# EAGLE design opt2bnc_trigger (EAGLE 9.4.2)
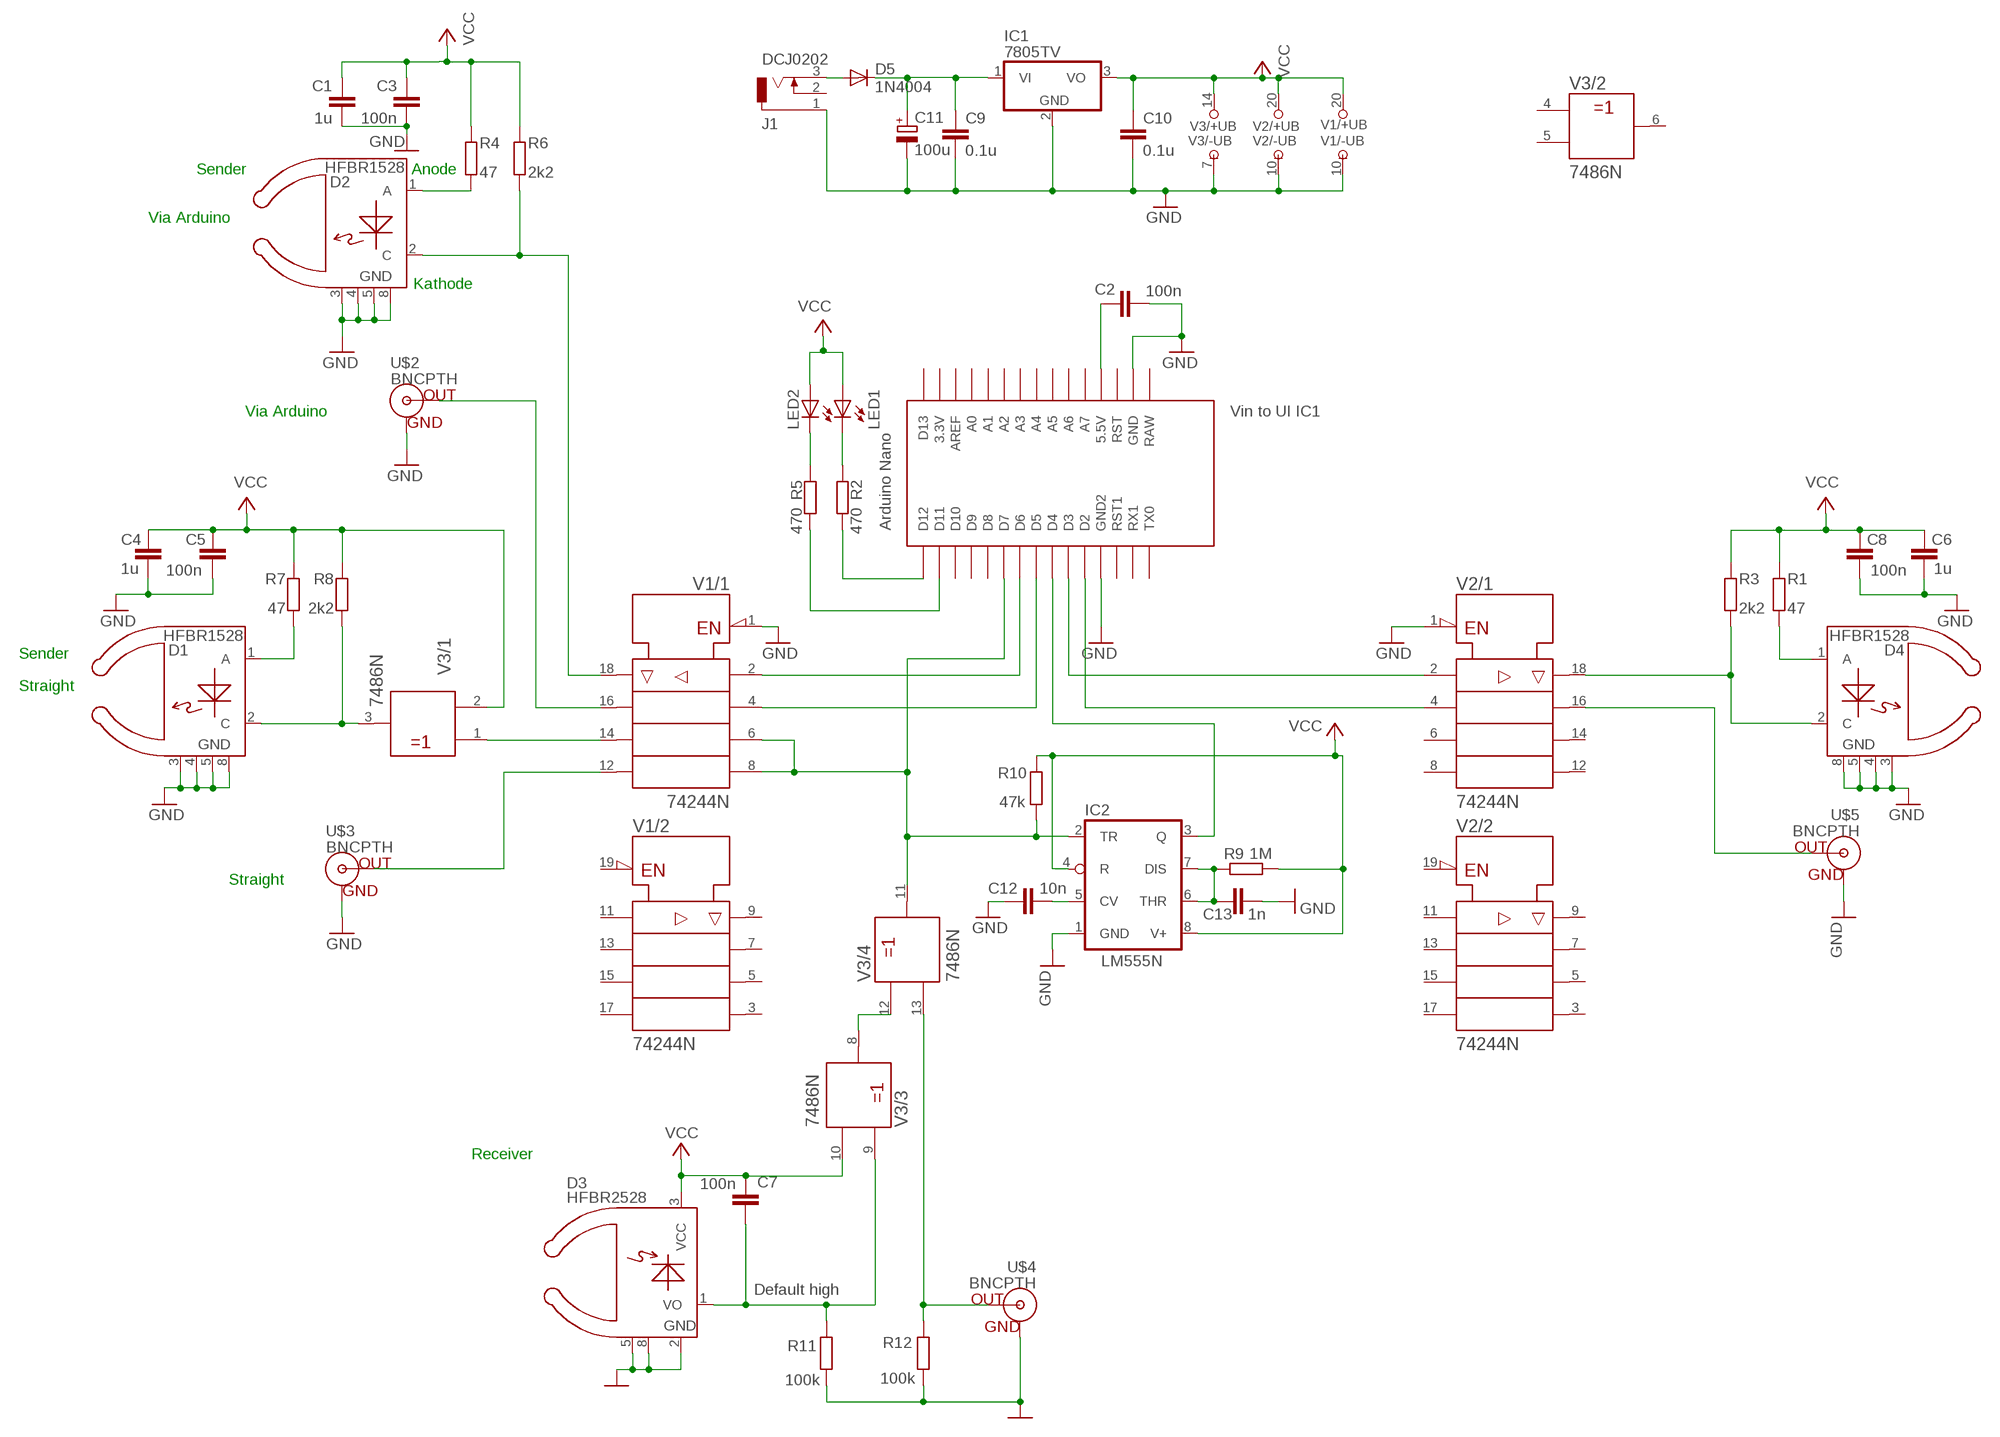
[diagram p0: schematic, sheet 1]

## Parts
C1  1u  C-EU025-025X050  [C025-025X050]
C2  100n  C-EU025-025X050  [C025-025X050]
C3  100n  C-EU025-025X050  [C025-025X050]
C4  1u  C-EU025-025X050  [C025-025X050]
C5  100n  C-EU025-025X050  [C025-025X050]
C6  1u  C-EU025-025X050  [C025-025X050]
C7  100n  C-EU025-025X050  [C025-025X050]
C8  100n  C-EU025-025X050  [C025-025X050]
C9  0.1u  C-EU025-024X044  [C025-024X044]
C10  0.1u  C-EU025-024X044  [C025-024X044]
C11  100u  CPOL-EUE2-4  [E2-4]
C12  10n  C-EU025-025X050  [C025-025X050]
C13  1n  C-EU025-025X050  [C025-025X050]
D1  HFBR1528  [HFBR25XX]
D2  HFBR1528  [HFBR25XX]
D3  HFBR2528  [HFBR25XX]
D4  HFBR1528  [HFBR25XX]
D5  1N4004  [DO41-10]
IC1  7805TV  [TO220V]
IC2  LM555N  [DIL08]
J1  DCJ0202  [DCJ0202]
LED1  LED3MM  [LED3MM]
LED2  LED3MM  [LED3MM]
R1  47  R-EU_0207/7  [0207/7]
R2  470  R-EU_0207/7  [0207/7]
R3  2k2  R-EU_0207/7  [0207/7]
R4  47  R-EU_0207/7  [0207/7]
R5  470  R-EU_0207/7  [0207/7]
R6  2k2  R-EU_0207/7  [0207/7]
R7  47  R-EU_0207/7  [0207/7]
R8  2k2  R-EU_0207/7  [0207/7]
R9  1M  R-EU_0207/7  [0207/7]
R10  47k  R-EU_0207/7  [0207/7]
R11  100k  R-EU_0207/7  [0207/7]
R12  100k  R-EU_0207/7  [0207/7]
U$1  NANO  [NANO]
U$2  BNCPTH  [BNC]
U$3  BNCPTH  [BNC]
U$4  BNCPTH  [BNC]
U$5  BNCPTH  [BNC]
V1  74244N  [DIL20]
V2  74244N  [DIL20]
V3  7486N  [DIL14]

## Nets
GND: C1.2 C2.2 C3.2 C4.2 C5.2 C6.2 C8.2 C9.2 C10.2 C11.- C12.1 C13.2 D1.3 D1.4 D1.5(GND) D1.8(GND) D2.3 D2.4 D2.5(GND) D2.8(GND) D3.2(GND) D3.5 D3.8 D4.3 D4.4 D4.5(GND) D4.8(GND) IC1.2(GND) IC2.1(GND) J1.1 R11.2 R12.2 U$1.GND U$1.GND1(GND2) U$2.GND U$3.GND U$4.GND U$5.GND V1.1(/1:!G) V1.10(/-UB:-UB) V2.1(/1:!G) V2.10(/-UB:-UB) V3.7(/-UB:-UB)
N$1: C9.1 C11.+ D5.C IC1.1(VI)
N$2: IC2.2(TR) R10.2 U$1.D7 V1.6(/1:A3) V1.8(/1:A4) V3.11(/4:Y)
N$3: D2.2(C) R6.1 V1.18(/1:Y1)
N$4: LED1.K(C) R2.1
N$5: U$1.D6 V1.2(/1:A1)
N$6: U$2.S(OUT) V1.16(/1:Y2)
N$7: U$1.D5 V1.4(/1:A2)
N$8: LED2.K(C) R5.1
N$9: C7.1 D3.1(VO) R11.1 V3.9(/3:A)
N$10: D2.1(A) R4.1
N$11: D5.A J1.3
N$12: R2.2 U$1.D12
N$13: R5.2 U$1.D11
N$14: D1.1(A) R7.1
N$15: U$3.S(OUT) V1.12(/1:Y4)
N$16: C2.1 U$1.5V(5.5V)
N$19: U$1.D2 V2.4(/1:A2)
N$20: U$1.D3 V2.2(/1:A1)
N$21: D1.2(C) R8.1 V3.3(/1:Y)
N$22: U$5.S(OUT) V2.16(/1:Y2)
N$23: D4.1(A) R1.1
N$24: D4.2(C) R3.1 V2.18(/1:Y1)
N$26: R12.1 U$4.S(OUT) V3.13(/4:B)
N$27: V3.8(/3:Y) V3.12(/4:A)
N$28: C12.2 IC2.5(CV)
N$29: C13.1 IC2.6(THR) IC2.7(DIS) R9.2
N$30: IC2.3(Q) U$1.D4
N$31: V1.14(/1:Y3) V3.1(/1:A)
VCC: C1.1 C3.1 C4.1 C5.1 C6.1 C7.2 C8.1 C10.1 D3.3(VCC) IC1.3(VO) IC2.4(R) IC2.8(V+) LED1.A LED2.A R1.2 R3.2 R4.2 R6.2 R7.2 R8.2 R9.1 R10.1 V1.20(/+UB:+UB) V2.20(/+UB:+UB) V3.2(/1:B) V3.10(/3:B) V3.14(/+UB:+UB)
Unconnected: J1.2 U$1.3.3V U$1.A0 U$1.A1 U$1.A2 U$1.A3 U$1.A4 U$1.A5 U$1.A6 U$1.A7 U$1.AREF U$1.D8 U$1.D9 U$1.D10 U$1.D13 U$1.ICSP1 U$1.ICSP2 U$1.ICSP3 U$1.ICSP4 U$1.ICSP5 U$1.ICSP6 U$1.RAW U$1.RST U$1.RST1 U$1.RX1 U$1.TX0 V1.3(/2:Y4) V1.5(/2:Y3) V1.7(/2:Y2) V1.9(/2:Y1) V1.11(/2:A1) V1.13(/2:A2) V1.15(/2:A3) V1.17(/2:A4) V1.19(/2:!G) V2.3(/2:Y4) V2.5(/2:Y3) V2.6(/1:A3) V2.7(/2:Y2) V2.8(/1:A4) V2.9(/2:Y1) V2.11(/2:A1) V2.12(/1:Y4) V2.13(/2:A2) V2.14(/1:Y3) V2.15(/2:A3) V2.17(/2:A4) V2.19(/2:!G) V3.4(/2:A) V3.5(/2:B) V3.6(/2:Y)

## Notes on the sheet
- Sender | Anode
- Via Arduino
- Kathode
- Via Arduino | Vin to UI IC1
- Sender
- Straight
- Straight
- Receiver
- Default high

## Library data of the parts
C1-C10 C12 C13 = rcl:C-EU: CAPACITOR, European symbol
C11 = rcl:CPOL-EU: POLARIZED CAPACITOR, European symbol
D1 D2 D4 = opto-transmittter-hp:HFBR1528: OPTO TRANSMITTER; MF: AGILENT TECHNOLOGIES; MPN: HFBR-1528; OC_FARNELL: 1247638; OC_NEWARK: 06F6056
D3 = opto-transmittter-hp:HFBR2528: OPTO RECEIVER; MF: AGILENT TECHNOLOGIES; MPN: HFBR-2528; OC_FARNELL: 1247664; OC_NEWARK: 06F6096
D5 = adafruit:1N4004: DIODE General purpose 1N400x type rectifier (With bigger pads) http://www.ladyada.net/library/pcb/eaglelibrary.html
IC1 = linear:78*: Positive VOLTAGE REGULATOR Source: http://cache.national.com/ds/LM/LM78L05.pdf http://www.fairchildsemi.com/ds/LM/LM7805.pdf
IC2 = linear:*555: TIMER
J1 = con-jack:DCJ0202: DC POWER JACK Source: DCJ0202.pdf; OC_FARNELL: unknown; OC_NEWARK: unknown
LED1 LED2 = led:LED: LED OSRAM: - CHIPLED LG R971, LG N971, LY N971, LG Q971, LY Q971, LO R971, LY R971 LH N974, LH R974 LS Q976, LO Q976, LY Q976 LO Q996 - Hyper CHIPLED LW Q18S LB Q993, LB Q99A, LB R99A - SideLED LS A670, LO A670, LY A670, LG A670, LP A670 LB A673, LV A673, LT A673, LW A673 LH A674 LY A675 LS A676, LA A676, LO A676, LY A676, LW A676 LS A679, LY A679, LG A679 - Hyper Micro SIDELED® LS Y876, LA Y876, LO Y876, LY Y876 LT Y87S - SmartLED LW L88C, LW L88S LB L89C, LB L89S, LG L890 LS L89K, LO L89K, LY L89K LS L896, LA L896, LO L896, LY L896 - TOPLED LS T670, LO T670, LY T670, LG T670, LP T670 LSG T670, LSP T670, LSY T670, LOP T670, LYG T670 LG T671, LOG T671, LSG T671 LB T673, LV T673, LT T673, LW T673 LH T674 LS T676, LA T676, LO T676, LY T676, LB T676, LH T676, LSB T676, LW T676 LB T67C, LV T67C, LT T67C, LS T67K, LO T67K, LY T67K, LW E67C LS E67B, LA E67B, LO E67B, LY E67B, LB E67C, LV E67C, LT E67C LW T67C LS T679, LY T679, LG T679 LS T770, LO T770, LY T770, LG T770, LP T770 LB T773, LV T773, LT T773, LW T773 LH T774 LS E675, LA E675, LY E675, LS T675 LS T776, LA T776, LO T776, LY T776, LB T776 LHGB T686 LT T68C, LB T68C - Hyper Mini TOPLED® LB M676 - Mini TOPLED Santana® LG M470 LS M47K, LO M47K, LY M47K Source: http://www.osram.convergy.de LUXEON: - LUMILED® LXK2-PW12-R00, LXK2-PW12-S00, LXK2-PW14-U00, LXK2-PW14-V00 LXK2-PM12-R00, LXK2-PM12-S00, LXK2-PM14-U00 LXK2-PE12-Q00, LXK2-PE12-R00, LXK2-PE12-S00, LXK2-PE14-T00, LXK2-PE14-U00 LXK2-PB12-K00, LXK2-PB12-L00, LXK2-PB12-M00, LXK2-PB14-N00, LXK2-PB14-P00, LXK2-PB14-Q00 LXK2-PR12-L00, LXK2-PR12-M00, LXK2-PR14-Q00, LXK2-PR14-R00 LXK2-PD12-Q00, LXK2-PD12-R00, LXK2-PD12-S00 LXK2-PH12-R00, LXK2-PH12-S00 LXK2-PL12-P00, LXK2-PL12-Q00, LXK2-PL12-R00 Source: www.luxeon.com KINGBRIGHT: KA-3528ASYC Source: www.kingbright.com
R1-R12 = rcl:R-EU_: RESISTOR, European symbol
U$1 = Arduino-clone:NANO: Arduino Nano
U$2-U$5 = tglib2:BNC: BNC Connector, Mouser Part# 5227161
V1 V2 = 74ttl-din:74*244: Octal BUFFER and LINE DRIVER, 3-state
V3 = 74ttl-din:74*86: Quad 2-input EXCLUSIV-OR gate

## Board
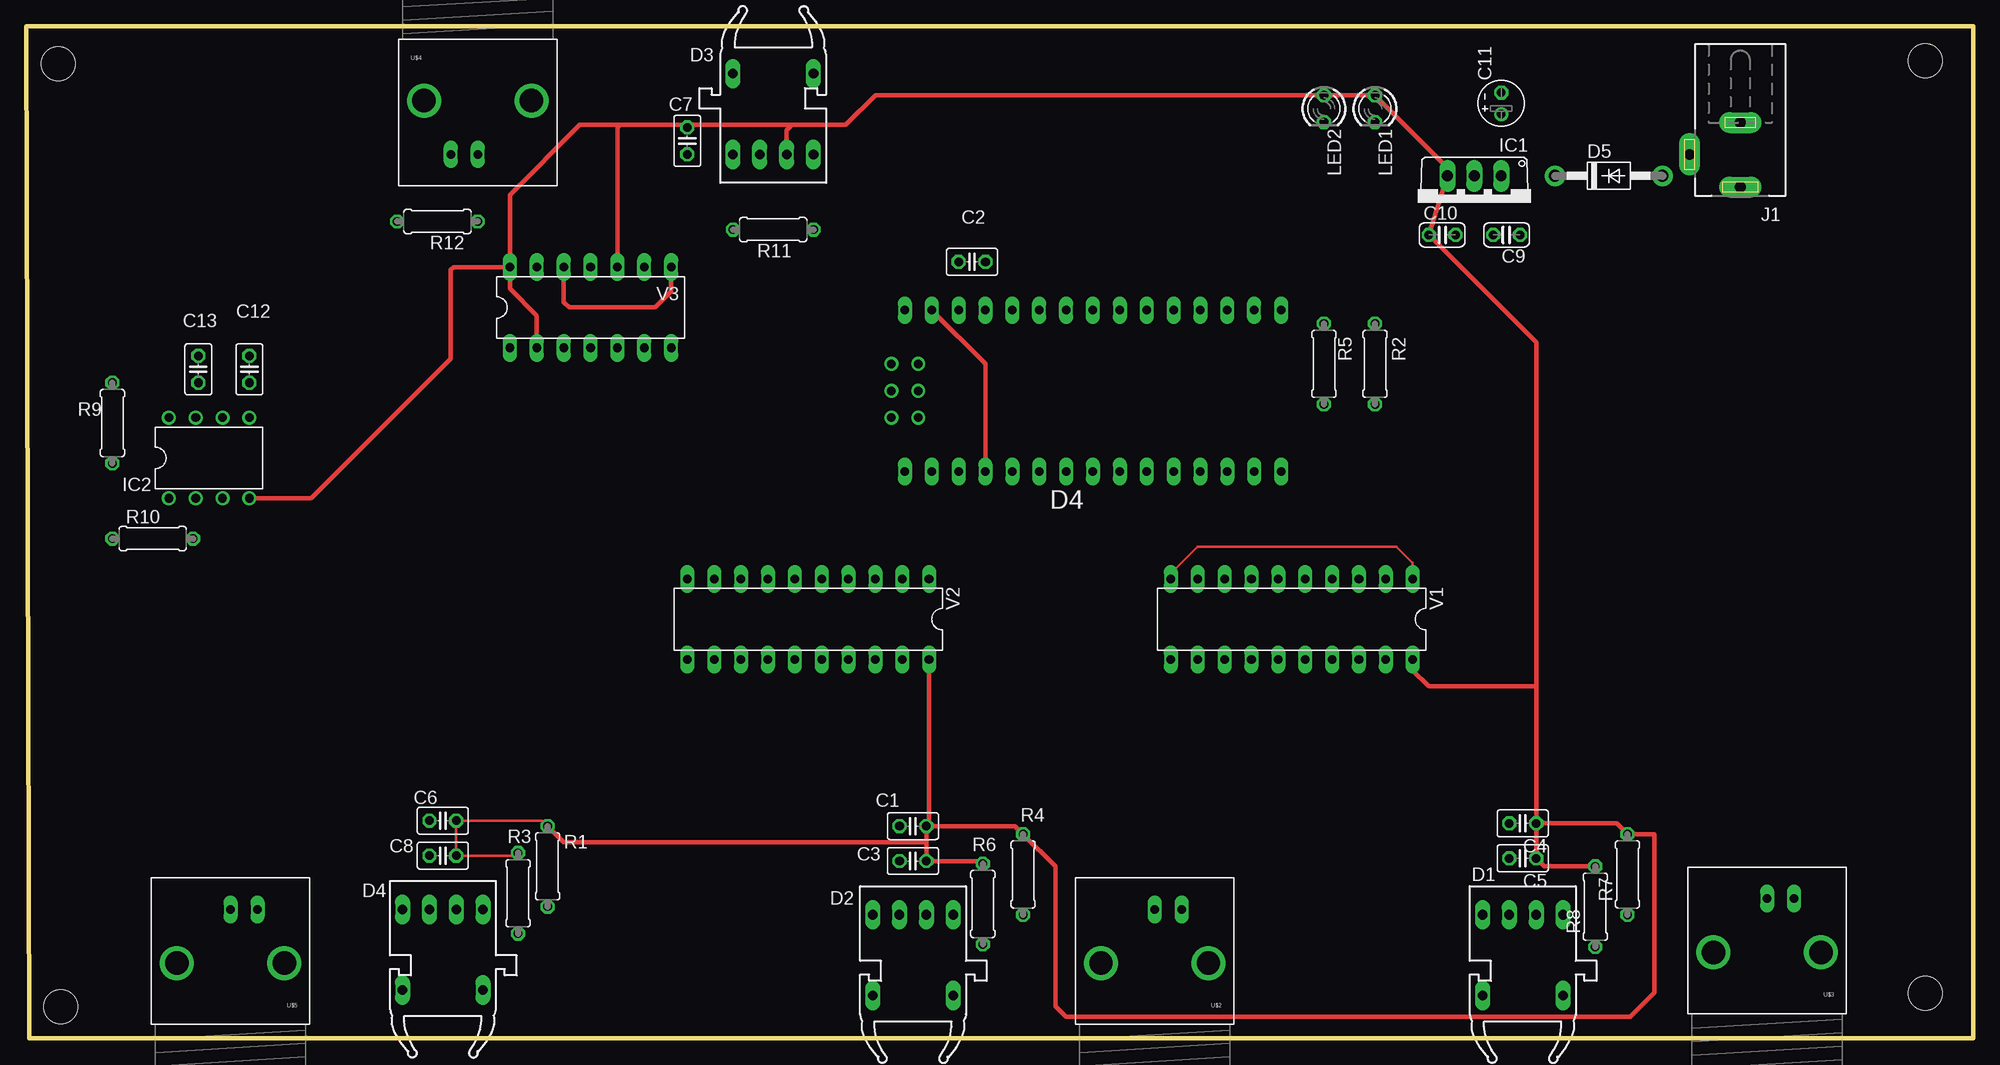
[diagram p1: board, top side]
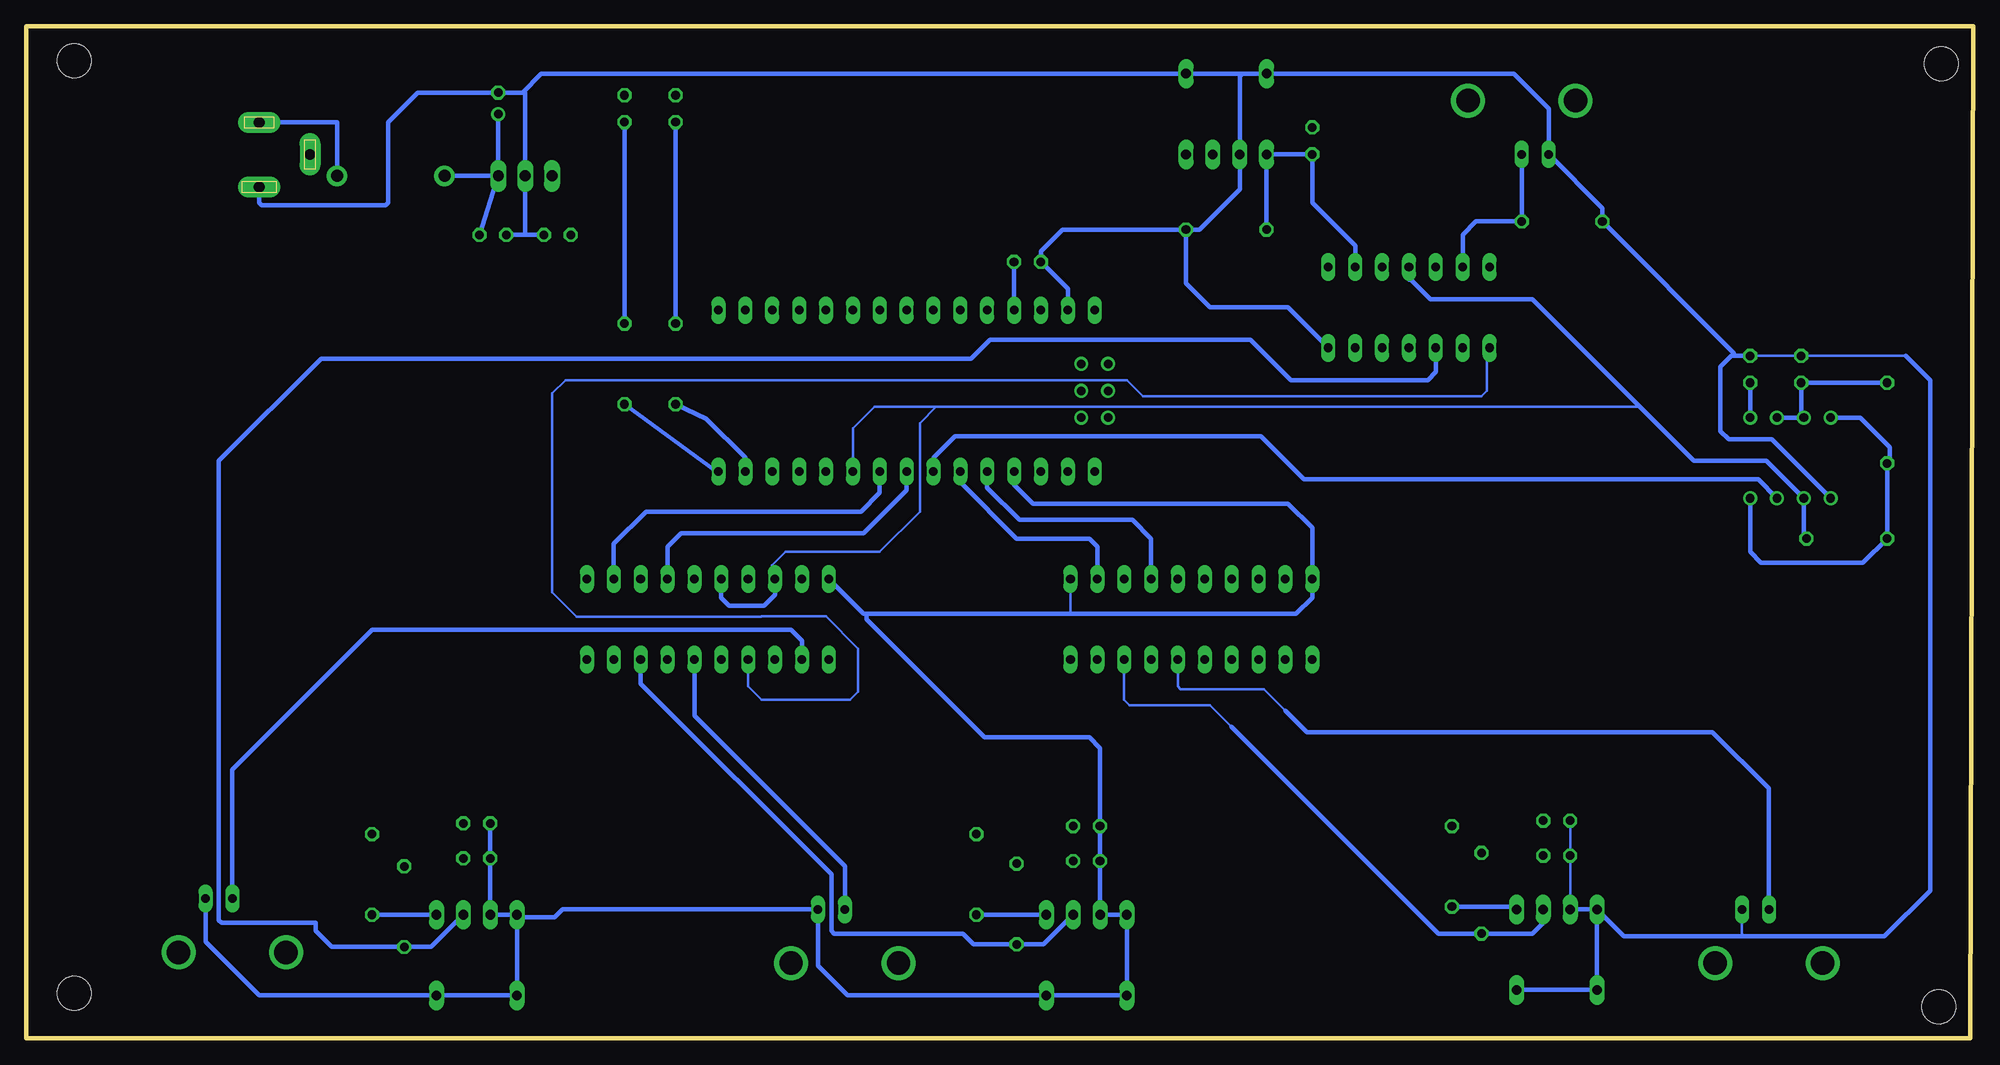
[diagram p2: board, bottom side, seen from below]

Size 184.06 x 95.65 mm. Coordinates in mm from the lower left corner, seen from the top.
Outline: 184.06,0 0.25,0 0,95.65 184.06,95.65 184.06,0
Copper layers (1*16): Top 0.035mm / dielectric 1.5mm / Bottom 0.035mm
Design rules "default": minimum track width 10mil, minimum drill 24mil, track to track 8mil, track to pad 8mil, pad to pad 8mil, via to via 8mil, smd to smd 8mil, copper to edge 40mil, drill to drill 8mil, minimum pad ring 10mil, minimum via ring 8mil, stop-mask expansion 4mil, vias tented up to drill 0mil, thermal gap 10mil
Holes 3.2 mm at 179.53,4.27 179.53,92.4 3.25,3 3,92.15

### Footprints (pad centres in the part's own frame; a part is rotated, then mirrored left to right if it is on the bottom)
C025-025X050 = drill 0.813 octagon: 1 -1.27,0; 2 1.27,0
C025-024X044 = drill 0.813 octagon: 1 -1.27,0; 2 1.27,0
E2-4 = drill 0.813 pad 1.27: + -1.016,0 | drill 0.813 pad 1.27 octagon: - 1.016,0
HFBR25XX = drill 0.9 long: 1 0,3.81; 2 0,1.27; 3 0,-1.27; 4 0,-3.81; 5 7.62,-3.81; 8 7.62,3.81
DO41-10 = drill 1.118 pad 1.93: A 5.08,0; C -5.08,0
TO220V = drill 1.016 long: 1 -2.54,-2.54; 2 0,-2.54; 3 2.54,-2.54
DIL08 = drill 0.813 pad 1.27: 1 -3.81,-3.81; 2 -1.27,-3.81; 3 1.27,-3.81; 4 3.81,-3.81; 5 3.81,3.81; 6 1.27,3.81; 7 -1.27,3.81; 8 -3.81,3.81
DCJ0202 = drill 1 pad 2 long: 1 0,3.1; 2 4.8,0; 3 0,-3
LED3MM = drill 0.813 octagon: A -1.27,0; K 1.27,0
0207/7 = drill 0.813 octagon: 1 -3.81,0; 2 3.81,0
NANO = drill 0.8 long: 3.3V -10.16,24.13; 5V -10.16,-1.27; A0 -10.16,19.05; A1 -10.16,16.51; A2 -10.16,13.97; A3 -10.16,11.43; A4 -10.16,8.89; A5 -10.16,6.35; A6 -10.16,3.81; A7 -10.16,1.27; AREF -10.16,21.59; D2 5.08,1.27; D3 5.08,3.81; D4 5.08,6.35; D5 5.08,8.89; D6 5.08,11.43; D7 5.08,13.97; D8 5.08,16.51; D9 5.08,19.05; D10 5.08,21.59; D11 5.08,24.13; D12 5.08,26.67; D13 -10.16,26.67; GND -10.16,-6.35; GND1 5.08,-1.27; RAW -10.16,-8.89; RST -10.16,-3.81; RST1 5.08,-3.81; RX1 5.08,-6.35; TX0 5.08,-8.89 | drill 0.8: ICSP1 -5.08,-10.16; ICSP2 -5.08,-7.62; ICSP3 -2.54,-10.16; ICSP4 -2.54,-7.62; ICSP5 0,-10.16; ICSP6 0,-7.62
BNC = drill 2.2: 3 -5.08,5.08; 4 5.08,5.08 | drill 0.8 long: GND -2.54,0; S 0,0
DIL20 = drill 0.813 long: 1 -11.43,-3.81; 2 -8.89,-3.81; 3 -6.35,-3.81; 4 -3.81,-3.81; 5 -1.27,-3.81; 6 1.27,-3.81; 7 3.81,-3.81; 8 6.35,-3.81; 9 8.89,-3.81; 10 11.43,-3.81; 11 11.43,3.81; 12 8.89,3.81; 13 6.35,3.81; 14 3.81,3.81; 15 1.27,3.81; 16 -1.27,3.81; 17 -3.81,3.81; 18 -6.35,3.81; 19 -8.89,3.81; 20 -11.43,3.81
DIL14 = drill 0.813 long: 1 -7.62,-3.81; 2 -5.08,-3.81; 3 -2.54,-3.81; 4 0,-3.81; 5 2.54,-3.81; 6 5.08,-3.81; 7 7.62,-3.81; 8 7.62,3.81; 9 5.08,3.81; 10 2.54,3.81; 11 0,3.81; 12 -2.54,3.81; 13 -5.08,3.81; 14 -7.62,3.81

### Placement (x,y rotation side)
C1  83.82,20.07 180 top
C2  89.41,73.41 180 top
C3  83.82,16.76 180 top
C4  141.48,20.32 180 top
C5  141.48,17.02 180 top
C6  39.37,20.57 180 top
C7  62.48,84.84 90 top
C8  39.37,17.27 180 top
C9  139.95,75.95 180 top
C10  133.86,75.95 0 top
C11  139.45,88.39 90 top
C12  21.08,63.25 270 top
C13  16.26,63.25 90 top
D1  141.48,11.68 270 top
D2  83.82,11.68 270 top
D3  70.61,83.57 90 top
D4  39.37,12.19 270 top
D5  149.61,81.53 0 top
IC1  136.91,78.99 180 top
IC2  17.27,54.86 0 top
J1  162.05,83.57 180 top
LED1  127.51,87.88 270 top
LED2  122.68,87.88 270 top
R1  49.28,16.26 90 top
R2  127.51,63.75 270 top
R3  46.48,13.72 90 top
R4  94.23,15.49 90 top
R5  122.68,63.75 270 top
R6  90.42,12.7 90 top
R7  151.38,15.49 90 top
R8  148.34,12.45 90 top
R9  8.13,58.17 90 top
R10  11.94,47.24 0 top
R11  70.61,76.45 0 top
R12  38.86,77.22 180 top
U$1  91.95,58.67 270 top
U$2  106.68,12.19 180 top
U$3  164.59,13.21 180 top
U$4  42.67,83.57 0 top
U$5  19.3,12.19 180 top
V1  119.63,39.62 180 top
V2  73.91,39.62 180 top
V3  53.34,69.09 0 top

### Tracks (layer width: path | path; a pad name or v marks a point on that pad's centre or on a via)
GND
  Top 0.254: V1.10 108.2,43.94 110.74,46.48 129.54,46.48 131.06,44.96 V1.1
  Top 0.406: U$1.GND 90.68,63.75 U$1.GND1
  Bottom 0.254: U$5.GND 21.84,9.91 21.59,9.65 | 6.35,64.52 C13.2 C12.1 | C6.2 C8.2 D4.3 | V2.1 85.34,40.39 85.09,40.13
  Bottom 0.406: 137.16,89.41 136.91,89.41 IC1.2 136.91,75.95 | 137.16,89.41 C11.- 147.07,89.41 149.86,86.61 149.86,78.99 150.11,78.74 161.8,78.74 162.05,78.99 J1.1 | C10.2 136.91,75.95 | 136.91,75.95 C9.2 | IC2.1 19.05,56.64 23.11,56.64 23.88,57.4 23.88,63.5 22.86,64.52 22.61,64.52 | 22.61,64.52 C12.1 | R11.2 73.15,76.45 69.34,80.26 D3.2 69.34,90.93 69.09,91.19 | 69.09,91.19 D3.8 43.43,91.19 40.13,87.88 U$4.GND 35.05,78.49 R12.2 22.61,64.77 22.61,64.52 | 69.09,91.19 D3.5 135.38,91.19 137.16,89.41 | V3.7 64.77,69.09 72.14,69.09 74.42,71.37 R11.2 | D4.8 D4.5 D4.4 | D4.4 D4.3 | 137.67,11.43 D1.4 D1.3 C5.2 C4.2 | 137.67,11.43 D1.5 D1.8 162.05,4.06 167.13,9.14 U$3.GND | 137.67,11.43 134.11,11.43 133.35,12.19 U$2.GND 109.22,6.86 106.43,4.06 D2.8 D2.5 D2.4 D2.3 C3.2 C1.2 82.55,27.43 83.57,28.45 93.47,28.45 104.65,39.62 104.65,40.13 | 6.35,64.52 4.06,62.23 4.06,13.97 8.38,9.65 21.59,9.65 33.02,9.65 D4.4 | U$1.GND1 90.68,52.32 88.9,50.55 64.77,50.55 62.48,48.26 V2.10 62.48,41.66 64.01,40.13 85.09,40.13 104.65,40.13 | R11.2 86.11,76.45 88.14,74.42 C2.2 85.6,70.87 U$1.GND | V1.10 104.9,40.13 104.65,40.13
N$1
  Bottom 0.406: IC1.1 D5.C | C11.+ IC1.1 | IC1.1 C9.1
N$2
  Bottom 0.254: V3.11 53.34,71.63 | 98.04,59.69 99.57,58.17 99.57,49.78 103.38,45.97 112.27,45.97 113.54,44.7 113.54,43.69 V1.8 | 31.37,59.56 31.5,59.69 98.04,59.69 | U$1.D7 105.92,57.66 103.89,59.69 98.04,59.69
  Bottom 0.406: R10.2 16,47.5 IC2.2 19.56,54.61 26.42,54.61 31.37,59.56 41.66,69.85 51.31,69.85 53.34,71.88 V3.11 | V1.6 118.36,41.66 117.6,40.89 114.3,40.89 113.28,41.91 V1.8
N$3
  Bottom 0.406: D2.2 87.88,8.89 R6.1 94.49,8.89 95.5,9.91 107.7,9.91 107.95,10.16 107.95,15.49 125.98,33.53 V1.18
N$4
  Bottom 0.406: R2.1 LED1.K
N$5
  Bottom 0.406: U$1.D6 103.38,51.56 105.16,49.78 125.48,49.78 128.52,46.74 V1.2
N$6
  Bottom 0.406: U$2.S 106.68,16.26 120.9,30.48 V1.16
N$7
  Bottom 0.406: U$1.D5 100.84,51.82 104.9,47.75 122.17,47.75 123.44,46.48 V1.4
N$8
  Bottom 0.406: LED2.K R5.1
N$9
  Bottom 0.406: R11.1 D3.1 C7.1 62.48,78.99 58.42,74.93 V3.9
N$10
  Bottom 0.406: D2.1 R4.1
N$11
  Bottom 0.406: D5.A 154.69,86.61 162,86.61 J1.3
N$12
  Bottom 0.406: R2.2 118.87,53.59 U$1.D12
N$13
  Bottom 0.406: U$1.D11 116.08,54.86 119.79,58.57 R5.2
N$14
  Bottom 0.406: D1.1 R7.1
N$15
  Bottom 0.406: U$3.S 164.59,25.4 151.38,38.61 111.76,38.61 110.74,37.59 V1.12
N$16
  Bottom 0.406: U$1.5V C2.1
N$19
  Bottom 0.406: U$1.D2 93.22,52.07 90.17,49.02 79.5,49.02 77.72,47.24 V2.4
N$20
  Bottom 0.406: U$1.D3 95.76,52.58 90.42,47.24 83.57,47.24 82.8,46.48 V2.2
N$21
  Bottom 0.406: 142.75,12.7 D1.2 145.8,8.64 R8.1 155.19,8.64 156.72,10.16 156.72,10.92 165.61,10.92 165.86,11.18 165.86,54.61 156.21,64.26 94.74,64.26 92.96,66.04 68.33,66.04 64.52,62.23 51.56,62.23 50.8,62.99 V3.3
N$22
  Bottom 0.254: 65.02,30.99 67.06,33.02 74.93,33.02 75.18,33.27 V2.16
  Bottom 0.406: U$5.S 19.3,23.62 24.64,28.96 62.99,28.96 65.02,30.99
N$23
  Bottom 0.406: D4.1 43.43,12.45 R1.1
N$24
  Bottom 0.254: 70.1,29.46 72.14,31.5 79.76,31.5 80.26,32 V2.18
  Bottom 0.406: D4.2 40.64,10.92 41.66,9.91 R3.1 50.55,9.91 70.1,29.46
N$26
  Bottom 0.406: U$4.S R12.1 46.99,77.22 48.26,75.95 V3.13
N$27
  Top 0.406: V3.12 50.8,69.6 51.31,69.09 59.44,69.09 60.96,70.61 V3.8
N$28
  Bottom 0.406: IC2.5 C12.2
N$29
  Bottom 0.406: IC2.6 IC2.7 16.26,58.93 C13.1 R9.2
N$30
  Bottom 0.406: IC2.3 20.32,52.83 63.25,52.83 67.31,56.9 96.27,56.9 98.3,54.86 U$1.D4
N$31
  Bottom 0.254: V3.1 45.97,65.02 45.97,61.21 46.48,60.71 78.49,60.71 80.01,62.23 133.1,62.23 134.37,60.96 134.37,42.16 132.05,39.85 114.59,39.85 114.56,39.88 108.46,39.88 105.41,36.83 105.41,32.77 106.17,32 114.55,32 115.82,33.27 V1.14
VCC
  Top 0.254: R3.2 46.23,17.27 C8.1 C6.1 48.77,20.57 R1.2
  Top 0.406: IC1.3 C10.1 142.75,65.79 142.75,33.27 | IC1.3 134.11,81.79 | 72.39,86.36 71.88,85.85 D3.3 | 72.39,86.36 77.47,86.36 80.26,89.15 LED2.A LED1.A 134.37,82.3 IC1.3 | V3.14 45.72,79.76 52.32,86.36 56.13,86.36 | 56.13,86.36 62.23,86.36 C7.2 62.74,86.36 72.39,86.36 | 85.09,18.54 C1.1 | 85.09,18.54 50.8,18.54 R1.2 | 85.09,18.54 C3.1 90.17,16.76 R6.2 | C1.1 93.47,20.07 R4.2 97.28,16.26 97.28,3.05 98.3,2.03 151.64,2.03 153.92,4.32 153.92,19.3 R7.2 150.37,20.32 C4.1 | C4.1 C5.1 143.51,16.26 R8.2 | V2.20 85.34,20.32 C1.1 | IC2.4 26.92,51.05 40.13,64.26 40.13,72.64 40.39,72.9 V3.14 | 142.75,33.27 C4.1 | V1.20 131.06,34.8 132.59,33.27 142.75,33.27 | V3.10 55.88,86.11 56.13,86.36 | V3.14 45.72,70.87 48.26,68.33 V3.2
  Bottom 0.406: IC2.8 10.67,58.67 7.87,55.88 7.87,54.61 R9.1 R10.1 10.41,44.96 20.07,44.96 21.08,45.97 IC2.4

### Text on the board
tPlace: D4
Document: A1 | A0